# Altium project ThumbsUp.PrjPcb
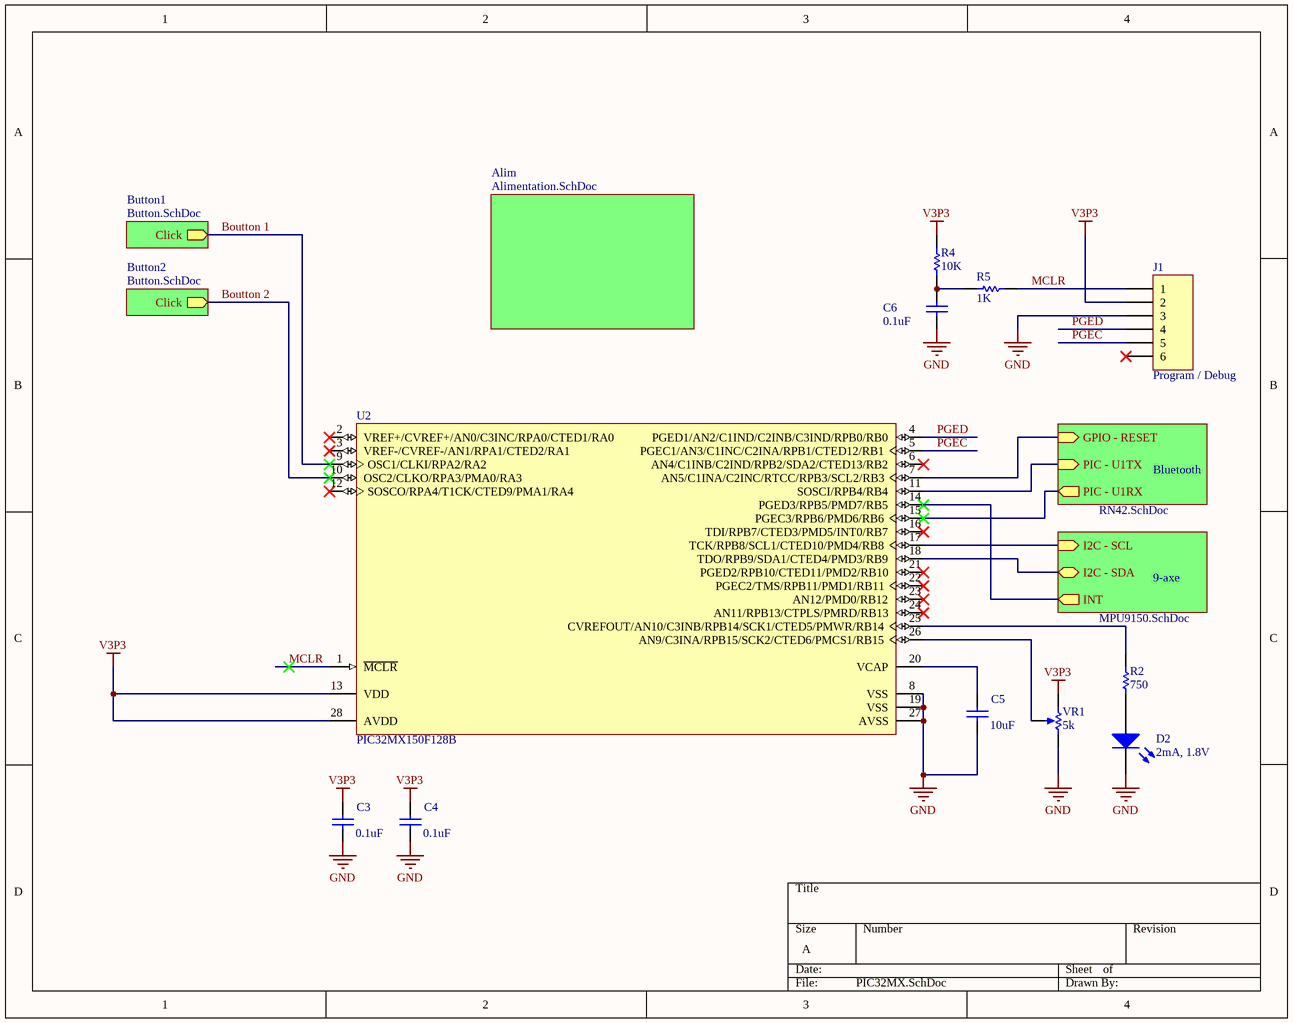
[diagram p0: PIC32MX.SchDoc]
5 sheets, 28 parts. Net scope: hierarchical (ports join the sheet entries above them; power ports are global).
Board file: PCB.PcbDoc
Sheets:
  PIC32MX.SchDoc
    Button2 = Button.SchDoc
    Button1 = Button.SchDoc
    9-axe = MPU9150.SchDoc
    Bluetooth = RN42.SchDoc
    Alim = Alimentation.SchDoc

## Sheet PIC32MX.SchDoc
size A

### Parts
C3  0.1uF  [CAP 0603]
C4  0.1uF  [CAP 0603]
C5  10uF  [CAP 0603]
C6  0.1uF  [CAP 0603]
D2  2mA, 1.8V  [LED]
J1  Program / Debug  [ICSP]
R2  750  [RES 0603]
R4  10K  [RES 0603]
R5  1K  [RES 0603]
U2  PIC32MX150F128B  [PIC32MX150F128B]
VR1  5k  [91A1A-B28-B13L]

### Sub-sheets
9-axe = MPU9150.SchDoc: I2C - SCL (in), I2C - SDA (bidir), INT (out)
Alim = Alimentation.SchDoc: no entries
Bluetooth = RN42.SchDoc: GPIO - RESET (in), PIC - U1TX (in), PIC - U1RX (out)
Button1 = Button.SchDoc: Click (out)
Button2 = Button.SchDoc: Click (out)

### Nets
GND: C3.1 C4.1 C5.1 C6.1 D2.2(K) J1.3 U2.8(VSS) U2.19(VSS) U2.27(AVSS) VR1.2(BOT)
V3P3: C3.2 C4.2 J1.2 R4.2 U2.13(VDD) U2.28(AVDD) VR1.1(TOP)
Boutton 1: U2.9(OSC1/CLKI/RPA2/RA2) ; sheet Button1/Click
Boutton 2: U2.10(OSC2/CLKO/RPA3/PMA0/RA3) ; sheet Button2/Click
MCLR: J1.1 R5.1 U2.1(~{MCLR})
PGEC: J1.5 U2.5(PGEC1/AN3/C1INC/C2INA/RPB1/CTED12/RB1)
PGED: J1.4 U2.4(PGED1/AN2/C1IND/C2INB/C3IND/RPB0/RB0)
NetC5_2: C5.2 U2.20(VCAP)
NetC6_2: C6.2 R4.1 R5.2
NetD2_1: D2.1(A) R2.1
NetM1_5: U2.7(AN5/C1INA/C2INC/RTCC/RPB3/SCL2/RB3) ; sheet Bluetooth/GPIO - RESET
NetM1_13: U2.11(SOSCI/RPB4/RB4) ; sheet Bluetooth/PIC - U1TX
NetM1_14: U2.15(PGEC3/RPB6/PMD6/RB6) ; sheet Bluetooth/PIC - U1RX
NetR2_2: R2.2 U2.25(CVREFOUT/AN10/C3INB/RPB14/SCK1/CTED5/PMWR/RB14)
NetU2_14: U2.14(PGED3/RPB5/PMD7/RB5) ; sheet 9-axe/INT
NetU2_17: U2.17(TCK/RPB8/SCL1/CTED10/PMD4/RB8) ; sheet 9-axe/I2C - SCL
NetU2_18: U2.18(TDO/RPB9/SDA1/CTED4/PMD3/RB9) ; sheet 9-axe/I2C - SDA
NetU2_26: U2.26(AN9/C3INA/RPB15/SCK2/CTED6/PMCS1/RB15) VR1.3(TAP)

Not connected (* = marked no-connect by the designer): J1 6*; U2 2(VREF+/CVREF+/AN0/C3INC/RPA0/CTED1/RA0)* 3(VREF-/CVREF-/AN1/RPA1/CTED2/RA1)* 6(AN4/C1INB/C2IND/RPB2/SDA2/CTED13/RB2)* 12(SOSCO/RPA4/T1CK/CTED9/PMA1/RA4)* 16(TDI/RPB7/CTED3/PMD5/INT0/RB7)* 21(PGED2/RPB10/CTED11/PMD2/RB10)* 22(PGEC2/TMS/RPB11/PMD1/RB11)* 23(AN12/PMD0/RB12)* 24(AN11/RPB13/CTPLS/PMRD/RB13)*

### Library data of the parts
C3-C6 = Cap: Capacitor; PackageReference: RAD-0.3; PackageDescription: Radial Cap, Thru-Hole; 2 Leads; 0.3 in Pin Spacing
  C3 C4 C6: Value: 0.1uF
  C5: Value: 10uF
D2 = LED0: Typical INFRARED GaAs LED; Fabricant: Kingbright; Fournisseur: Farnell; RefFabricant: KPT-2012LVSECK-J3-PRV; RefFournisseur: 2610416; PackageReference: LED-0; PackageDescription: LED; 2 Leads; Value: 2mA, 1.8V
J1 = MHDR1X6: Header, 6-Pin; Fabricant: MOLEX; Fournisseur: Farnell; RefFournisseur: 9731172; PackageDescription: Debug Interface; RefFabricant: 22-27-2061
R2 R4 R5 = Res1: Resistor; PackageReference: AXIAL-0.3; PackageDescription: Axial Device, Thru-Hole; 2 Leads; 0.3 in Pin Spacing
  R2: Value: 750
  R4: Value: 10K
  R5: Value: 1K
U2 = PIC32MX130F256B: PIC32MX Family Microcontroller; Fournisseur: Farnell; Fabricant: Microchip; RefFabricant: PIC32MX150F128B-I/SO; RefFournisseur: 2313766; PackageDescription: Pic32; PackageReference: SOIC
VR1 = RPot: Potentiometer; Set Position: 0.5; Fabricant: Bourns; Fournisseur: Farnell; RefFournisseur: 9357750; PackageReference: VR5; PackageDescription: Variable Resistor, Thru-Hole; 3 Leads; Value: 5K; RefFabricant: 91A1A-B28-B13L

## Sheet Button.SchDoc
size A
Used 2 times, as channels Button2, Button1. Parts and nets are listed once, with the designators drawn on the sheet.
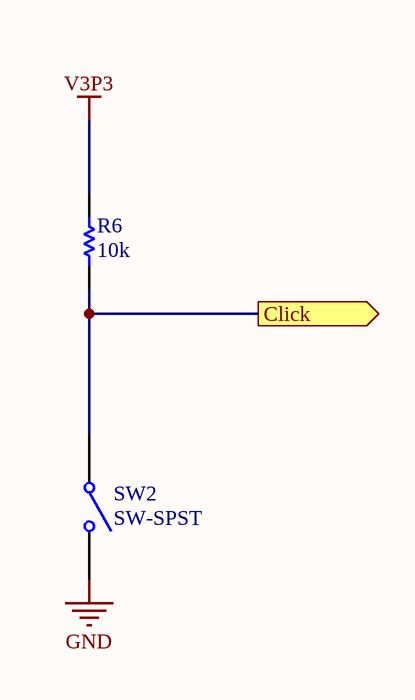
[diagram p1: Button.SchDoc]

### Parts
R6  10k  [RES 0603]
SW2  SW-SPST  [SWITCH]

### Ports
Click (out)

### Nets
GND: SW2.2(NO)
V3P3: R6.2
Click: R6.1 SW2.1(COMMON) ; port Click

### Channels
Button2: designators end in _Button2; ports Click=Boutton 2
Button1: designators end in _Button1; ports Click=Boutton 1

### Library data of the parts
R6 = Res1: Resistor; PackageReference: AXIAL-0.3; PackageDescription: Axial Device, Thru-Hole; 2 Leads; 0.3 in Pin Spacing; Value: 10k
SW2 = SW-SPST: Single-Pole, Single-Throw Switch; Fournisseur: Farnell; Fabricant: ALCOSWITCH - TE CONNECTIVITY; RefFabricant: 1437566-3; RefFournisseur: 2468741; PackageReference: SPST-2; PackageDescription: Switch; 2 Leads

## Sheet MPU9150.SchDoc
size A
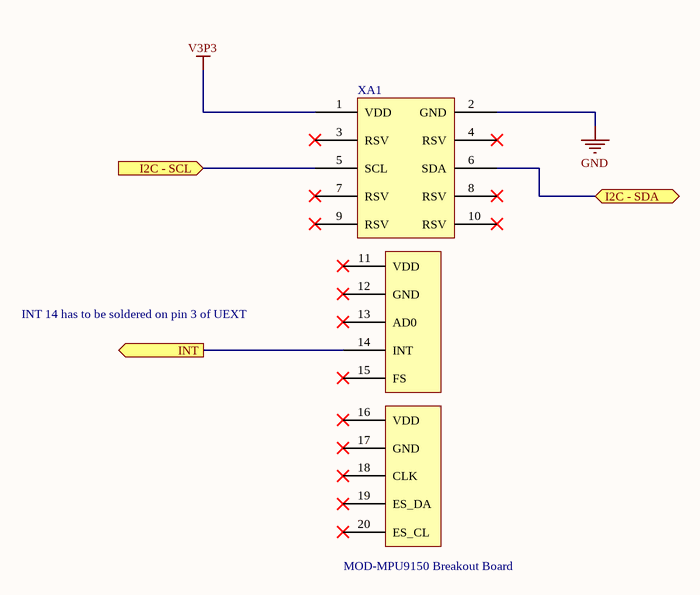
[diagram p2: MPU9150.SchDoc]

### Parts
XA1  MOD-MPU9150 Breakout Board  [MOD-MPU9150]

### Ports
I2C - SCL (in), I2C - SDA (bidir), INT (out)

### Nets
GND: XA1.2(GND)
V3P3: XA1.1(VDD)
NetU2_14: XA1.14(INT) ; port INT
NetU2_17: XA1.5(SCL) ; port I2C - SCL
NetU2_18: XA1.6(SDA) ; port I2C - SDA

Not connected (* = marked no-connect by the designer): XA1 3(RSV)* 4(RSV)* 7(RSV)* 8(RSV)* 9(RSV)* 10(RSV)* 11(VDD)* 12(GND)* 13(AD0)* 15(FS)* 16(VDD)* 17(GND)* 18(CLK)* 19(ES_DA)* 20(ES_CL)*

### Notes on the sheet
- INT 14 has to be soldered on pin 3 of UEXT

### Library data of the parts
XA1 = MPU9150: MPU9150 Breakout Board, displaying 3 headers; Fournisseur: Farnell; RefFournisseur: 2134098; Fabricant: 3M; RefFabricant: 30310-5002HB.; PackageDescription: 9axes

## Sheet RN42.SchDoc
size A
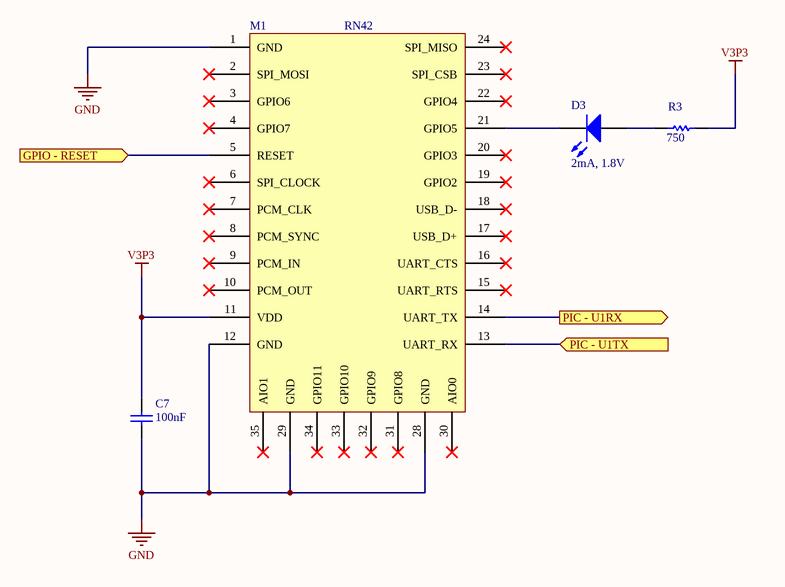
[diagram p3: RN42.SchDoc]

### Parts
C7  value 100nF  [CAP 0603]  (hidden comment: Cap)
D3  2mA, 1.8V  [LED]
M1  RN42  [RN42]
R3  750  [RES 0603]

### Ports
GPIO - RESET (in), PIC - U1RX (out), PIC - U1TX (in)

### Nets
GND: C7.1 M1.1(GND) M1.12(GND) M1.28(GND) M1.29(GND)
V3P3: C7.2 M1.11(VDD) R3.2
NetD3_1: D3.1(A) R3.1
NetD3_2: D3.2(K) M1.21(GPIO5)
NetM1_5: M1.5(RESET) ; port GPIO - RESET
NetM1_13: M1.13(UART_RX) ; port PIC - U1TX
NetM1_14: M1.14(UART_TX) ; port PIC - U1RX

Not connected (* = marked no-connect by the designer): M1 2(SPI_MOSI)* 3(GPIO6)* 4(GPIO7)* 6(SPI_CLOCK)* 7(PCM_CLK)* 8(PCM_SYNC)* 9(PCM_IN)* 10(PCM_OUT)* 15(UART_RTS)* 16(UART_CTS)* 17(USB_D+)* 18(USB_D-)* 19(GPIO2)* 20(GPIO3)* 22(GPIO4)* 23(SPI_CSB)* 24(SPI_MISO)* 30(AIO0)* 31(GPIO8)* 32(GPIO9)* 33(GPIO10)* 34(GPIO11)* 35(AIO1)*

### Library data of the parts
C7 = Cap: Capacitor; PackageReference: RAD-0.3; PackageDescription: Radial Cap, Thru-Hole; 2 Leads; 0.3 in Pin Spacing
D3 = LED0: as D2 on sheet PIC32MX; PackageReference: LED-0; PackageDescription: LED; 2 Leads; Value: 2mA, 1.8V
M1 = RN42: RN42 Bluetooth Module by Roven Networks; Fournisseur: Farnell; Fabricant: Microchip; RefFabricant: RN42HID-I/RM; RefFournisseur: 2775075; PackageDescription: Bluetooth
R3 = Res1: Resistor; PackageReference: AXIAL-0.3; PackageDescription: Axial Device, Thru-Hole; 2 Leads; 0.3 in Pin Spacing; Value: 750

## Sheet Alimentation.SchDoc
size A
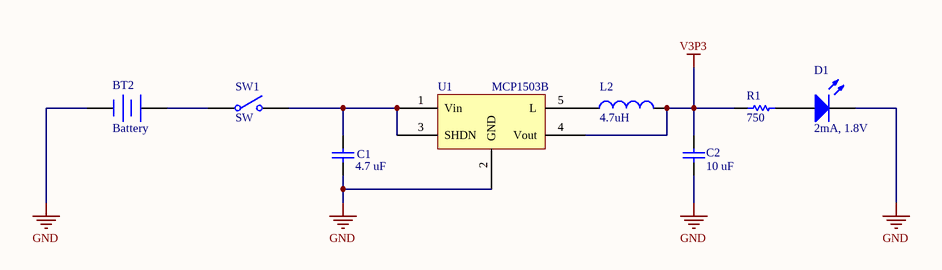
[diagram p4: Alimentation.SchDoc]

### Parts
BT2  Battery  [Battery Holder]
C1  4.7 uF  [CAP 0603]
C2  10 uF  [CAP 0603]
D1  2mA, 1.8V  [LED]
L2  4.7uH  [Coil]
R1  750  [RES 0603]
SW1  SW  [SWITCH ON/OFF]
U1  MCP1503B  [MCP1603B/TSOT]

### Nets
GND: BT2.2(-) C1.1 C2.1 D1.2(K) U1.2(GND)
V3P3: C2.2 L2.2 R1.2 U1.4(Vout)
NetBT2_1: BT2.1(+) SW1.1(COMMON)
NetC1_2: C1.2 SW1.2(NO) U1.1(Vin) U1.3(SHDN)
NetD1_1: D1.1(A) R1.1
NetL2_1: L2.1 U1.5(L)

### Library data of the parts
BT2 = Battery: Multicell Battery; Fabricant: Keystone; Fournisseur: Farnell; RefFabricant: 1017; RefFournisseur: 1888395; PackageReference: BAT-2; PackageDescription: Battery; 2 Leads
C1 C2 = Cap: Capacitor; Value: 4.7uF; PackageReference: RAD-0.3; PackageDescription: Radial Cap, Thru-Hole; 2 Leads; 0.3 in Pin Spacing
D1 = LED0: as D2 on sheet PIC32MX; PackageReference: LED-0; PackageDescription: LED; 2 Leads; Value: 2mA, 1.8V
L2 = Inductor: Code_IEC: 1005; Fabricant: Coilcraft; Fournisseur: Farnell; RefFabricant: XFL3012-472MEB; RefFournisseur: 2289189; PackageReference: 0402-A; PackageDescription: Chip Inductor; Code_JEITA: 0402; Value: 4.7uH
R1 = Res1: Resistor; PackageReference: AXIAL-0.3; PackageDescription: Axial Device, Thru-Hole; 2 Leads; 0.3 in Pin Spacing; Value: 750
SW1 = SW-SPST: Single-Pole, Single-Throw Switch; Fabricant: ERG COMPONENTS; Fournisseur: Farnell; RefFabricant: SDS-1-017; RefFournisseur: 1203424; PackageReference: SPST-2; PackageDescription: Switch; 2 Leads
U1 = MCP1603B: Fixed 3.3Vout 0.5Aout regulator; Fabricant: Microchip; RefFabricant: MCP1603T-330I/OS; Fournisseur: Farnell; RefFournisseur: 1439373; PackageDescription: Regulator

## Nets that join several sheets
GND: PIC32MX (10 pins), Button2 (SW2_Button2.2), Button1 (SW2_Button1.2), MPU9150 (XA1.2), RN42 (5 pins), Alimentation (5 pins)
V3P3: PIC32MX (7 pins), Button2 (R6_Button2.2), Button1 (R6_Button1.2), MPU9150 (XA1.1), RN42 (C7.2 M1.11 R3.2), Alimentation (C2.2 L2.2 R1.2 U1.4)
Boutton 1: PIC32MX (U2.9), Button1 (R6_Button1.1 SW2_Button1.1)
Boutton 2: PIC32MX (U2.10), Button2 (R6_Button2.1 SW2_Button2.1)
NetM1_5: PIC32MX (U2.7), RN42 (M1.5)
NetM1_13: PIC32MX (U2.11), RN42 (M1.13)
NetM1_14: PIC32MX (U2.15), RN42 (M1.14)
NetU2_14: PIC32MX (U2.14), MPU9150 (XA1.14)
NetU2_17: PIC32MX (U2.17), MPU9150 (XA1.5)
NetU2_18: PIC32MX (U2.18), MPU9150 (XA1.6)